# EAGLE board InkTime-SmartWatch (EAGLE 9.7.0)
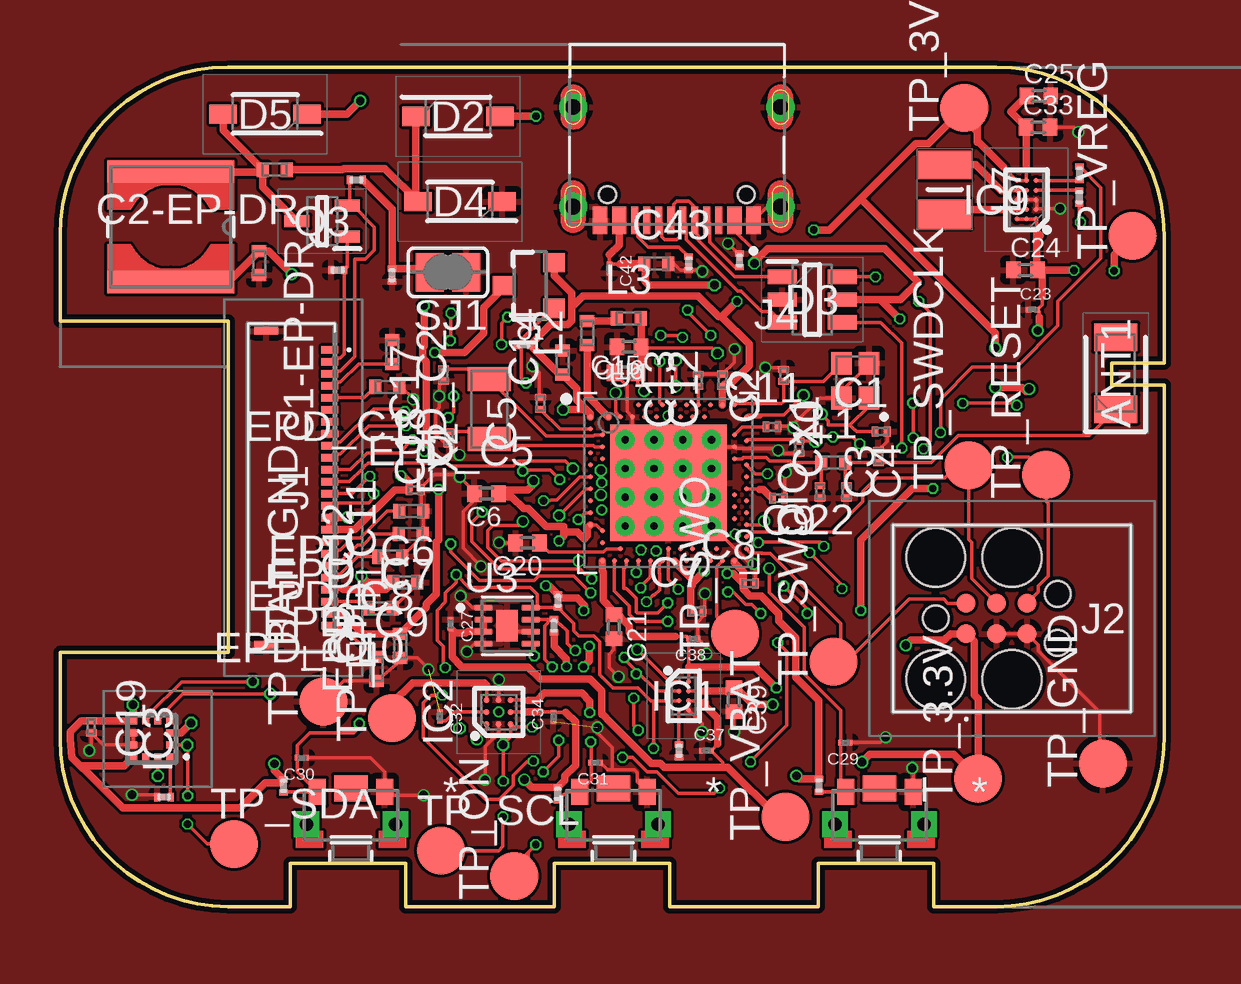
[diagram p2: board, top side]
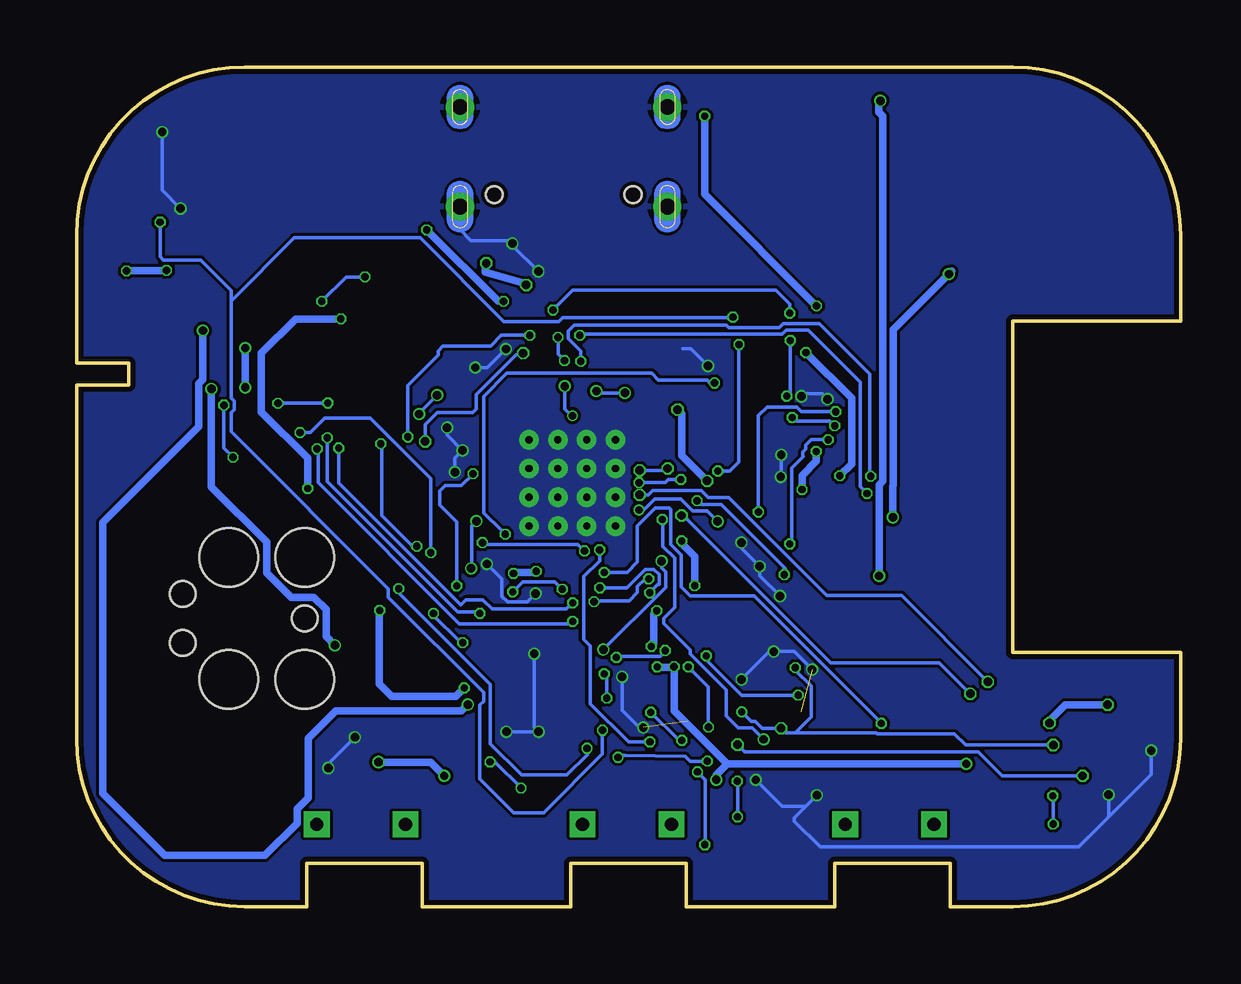
[diagram p3: board, bottom side, seen from below]

Size 46 x 35 mm. Coordinates in mm from the lower left corner, seen from the top.
Outline: 39,0 36.4,0 36.4,1.8 31.6,1.8 31.6,0 25.4,0 25.4,1.8 20.6,1.8 20.6,0 14.4,0 14.4,1.8 9.6,1.8 9.6,0 7,0 arc-90 0,7 0,10.6 7,10.6 7,24.4 0,24.4 0,28 arc-90 7,35 39,35 arc-90 46,28 46,22.66 43.83,22.66 43.83,21.75 46,21.75 46,7 arc-90 39,0
Copper layers (1*16): Top 0.035mm / dielectric 1.6mm / Bottom 0.035mm
Design rules "jlcpcb-2layers.dru": minimum track width 5mil, minimum drill 0.3mm, track to track 5mil, track to pad 5mil, pad to pad 5mil, via to via 5mil, smd to smd 5mil, copper to edge 0.2mm, drill to drill 6mil, minimum pad ring 10mil, minimum via ring 3mil, stop-mask expansion 4mil, vias tented up to drill 0mil, thermal gap 10mil

## Footprints (pad centres in the part's own frame; a part is rotated, then mirrored left to right if it is on the bottom)
2450AT18B100E_ANTC3216X140N = smd 1.15 x 1.8: 1 -1.5,0; 2 1.5,0
NORDIC_NRF_3_RESC0201_L = smd 0.28 x 0.43: 1 -0.255,0; 2 0.255,0
NORDIC_NRF_3_RESC0402_L = smd 0.5 x 0.6: 1 -0.5,0; 2 0.5,0
PERFECT_0402_0402 = smd 0.6 x 0.7: 1 -0.5,0; 2 0.5,0
GRM011R60J152KE01L_2_CAPC0201X13N = smd 0.22 x 0.23: 1 -0.185,0; 2 0.185,0
ESP32_C6_LIBRARY_5_SOD3716X135N = smd 1.15 x 0.8: 1 -1.75,0; 2 1.75,0
ESP32_C6_LIBRARY_3_SOT95P280X145-6N = smd 1.2 x 0.6: 1 -1.25,0.95; 2 -1.25,0; 3 -1.25,-0.95; 4 1.25,-0.95; 5 1.25,0; 6 1.25,0.95
BQ25180YBGR_BGA8C40P2X4_100X155X50 = smd 0.2 x 0.2: A1 -0.2,0.6; A2 0.2,0.6; B1 -0.2,0.2; B2 0.2,0.2; C1 -0.2,-0.2; C2 0.2,-0.2; D1 -0.2,-0.6; D2 0.2,-0.6
DRV2605YZFR_BGA9C50P3X3_144X144X62 = smd 0.25 x 0.25: A1 -0.5,0.5; A2 0,0.5; A3 0.5,0.5; B1 -0.5,0; B2 0,0; B3 0.5,0; C1 -0.5,-0.5; C2 0,-0.5; C3 0.5,-0.5
BMA423_BMA423 = smd 0.3 x 0.35: 1 -0.75,-0.775; 2 -0.25,-0.775; 3 0.25,-0.775; 4 0.75,-0.775; 7 0.75,0.775; 8 0.25,0.775; 9 -0.25,0.775; 10 -0.75,0.775 | smd 0.35 x 0.3: 5 0.775,-0.25; 6 0.775,0.25; 11 -0.775,0.25; 12 -0.775,-0.25
RT6160AWSC_BGA15C40P3X5_140X230X60 = smd 0.216 x 0.216: A1 -0.4,0.8; A2 0,0.8; A3 0.4,0.8; B1 -0.4,0.4; B2 0,0.4; B3 0.4,0.4; C1 -0.4,0; C2 0,0; C3 0.4,0; D1 -0.4,-0.4; D2 0,-0.4; D3 0.4,-0.4; E1 -0.4,-0.8; E2 0,-0.8; E3 0.4,-0.8
503480-2400_5034802400 = smd 0.3 x 0.7: 1 -5.75,1.525; 2 -5.25,1.525; 3 -4.75,1.525; 4 -4.25,1.525; 5 -3.75,1.525; 6 -3.25,1.525; 7 -2.75,1.525; 8 -2.25,1.525; 9 -1.75,1.525; 10 -1.25,1.525; 11 -0.75,1.525; 12 -0.25,1.525; 13 0.25,1.525; 14 0.75,1.525; 15 1.25,1.525; 16 1.75,1.525; 17 2.25,1.525; 18 2.75,1.525; 19 3.25,1.525; 20 3.75,1.525; 21 4.25,1.525; 22 4.75,1.525; 23 5.25,1.525; 24 5.75,1.525 | smd 0.3 x 1: MP1 -6.54,-1.125; MP2 6.54,-1.125
TC2030-IDC_TC2030IDC = smd 0.783 x 0.783: 1 -0.953,-0.635; 2 -0.953,0.635; 3 0.317,-0.635; 4 0.317,0.635; 5 1.588,-0.635; 6 1.588,0.635 | hole 2.451: -2.223,-2.54; -2.223,2.54; 0.952,-2.54; 0.952,2.54 | hole 1.067: -2.223,0; 2.857,-1.016; 2.857,1.016
KH-TYPE-C-16P_KINGHELM_KH-TYPE-C-16P = smd 0.6 x 1.15: A1_B12 -3.2,4.725; A4_B9 -2.4,4.725; A9_B4 2.4,4.725; A12_B1 3.2,4.725 | smd 0.3 x 1.15: A5 -1.25,4.725; A6 -0.25,4.725; A7 0.25,4.725; A8 1.25,4.725; B5 1.75,4.725; B6 0.75,4.725; B7 -0.75,4.725; B8 -1.75,4.725 | drill 0.65 pad 1.05: SH1 -4.32,0; SH2 4.32,0; SH3 -4.32,4.15; SH4 4.32,4.15 | hole 0.7: -2.89,3.65; 2.89,3.65
NORDIC_NRF_2_RESC0402_L = smd 0.5 x 0.6: 1 -0.5,0; 2 0.5,0
ESP32_C6_LIBRARY_2_IND_4828-WE-TPC_WRE = smd 0.9 x 5.3: 1 -2.286,0; 2 2.286,0
MLP2016SR47MT0S1_INDC2016X100N = smd 1.2 x 2.2: 1 -1.028,0; 2 1.028,0
ESP32_C6_LIBRARY_4_ESP32_C6_LIBRARY_4_ESP32_C6_LIBRARY_4_ESP32_C6_LIBRARY_4_ESP32_WROVER_SPARKFUN-DISCRETESEMI_SOT23-3 = smd 0.8 x 0.9: 1 -0.95,-1; 2 0.95,-1; 3 0,1.1
ESP32_C6_LIBRARY_6_SOT65P210X110-3N = smd 1.05 x 0.5: 1 -1.05,0.65; 2 -1.05,-0.65; 3 1.05,0
CPF0201D7K68C1_0201 = smd 0.35 x 0.25: 1 0,0.275; 2 0,-0.275
ESP32_C6_LIBRARY_7_JUMPER_SJ = smd 1.168 x 1.6: 1 -0.762,0; 2 0.762,0
2025-10-22_07-23-44_LIBRARY_SW_EVP-AKE31A_PAN = smd 0.711 x 1.092: 1 -1.4,-0.972; 2 1.4,-0.972 | drill 0.559 pad 0.914 square: 3 -1.848,0.381; 4 1.848,0.381 | smd 1.397 x 1.092: 5 0,-1.124
HECTOR_WATCH_1_TP20R = smd 2 x 2: TP 0,0
NORDIC_NRF_4_AQFN50P700X700X85_HS-74N = smd 4.85 x 4.85: P$74 0,0 | drill 0.3 pad 0.6: P$75 -1.8,1.8; P$76 -0.6,1.8; P$77 0.6,1.8; P$78 1.8,1.8; P$79 -1.8,0.6; P$80 -0.6,0.6; P$81 0.6,0.6; P$82 1.8,0.6; P$83 -1.8,-0.6; P$84 -0.6,-0.6; P$85 0.6,-0.6; P$86 1.8,-0.6; P$87 -1.8,-1.8; P$88 -0.6,-1.8; P$89 0.6,-1.8; P$90 1.8,-1.8 | smd 0.2 x 0.2: P$A8 -1.25,3.25; P$A10 -0.75,3.25; P$A12 -0.25,3.25; P$A14 0.25,3.25; P$A16 0.75,3.25; P$A18 1.25,3.25; P$A20 1.75,3.25; P$A22 2.25,3.25; P$A23 2.75,3.25; P$AA24 3.25,-2.25; P$AB2 -2.75,-2.5; P$AC5 -2,-2.75; P$AC9 -1,-2.75; P$AC11 -0.5,-2.75; P$AC13 0,-2.75; P$AC15 0.5,-2.75; P$AC17 1,-2.75; P$AC19 1.5,-2.75; P$AC21 2,-2.75; P$AC24 3.25,-2.75; P$AD2 -2.75,-3.25; P$AD4 -2.25,-3.25; P$AD6 -1.75,-3.25; P$AD8 -1.25,-3.25; P$AD10 -0.75,-3.25; P$AD12 -0.25,-3.25; P$AD14 0.25,-3.25; P$AD16 0.75,-3.25; P$AD18 1.25,-3.25; P$AD20 1.75,-3.25; P$AD22 2.25,-3.25; P$AD23 2.75,-3.25; P$B1 -3.25,2.75; P$B3 -2.5,2.75; P$B5 -2,2.75; P$B7 -1.5,2.75; P$B9 -1,2.75; P$B11 -0.5,2.75; P$B13 0,2.75; P$B15 0.5,2.75; P$B17 1,2.75; P$B19 1.5,2.75; P$B24 3.25,2.75; P$C1 -3.25,2.25; P$D2 -2.75,2; P$D23 2.75,2; P$E24 3.25,1.75; P$F2 -2.75,1.5; P$F23 2.75,1.5; P$G1 -3.25,1.25; P$H2 -2.75,1; P$H23 2.75,1; P$J1 -3.25,0.75; P$J24 3.25,0.75; P$K2 -2.75,0.5; P$L1 -3.25,0.25; P$L24 3.25,0.25; P$M2 -2.75,0; P$N1 -3.25,-0.25; P$N24 3.25,-0.25; P$P2 -2.75,-0.5; P$P23 2.75,-0.5; P$R1 -3.25,-0.75; P$R24 3.25,-0.75; P$T2 -2.75,-1; P$T23 2.75,-1; P$U1 -3.25,-1.25; P$U24 3.25,-1.25; P$V23 2.75,-1.5; P$W1 -3.25,-1.75; P$W24 3.25,-1.75; P$Y2 -2.75,-2; P$Y23 2.75,-2
ESP32_C6_LIBRARY_SON50P200X200X80-9N = smd 0.76 x 0.27: 1 -0.985,0.75; 2 -0.985,0.25; 3 -0.985,-0.25; 4 -0.985,-0.75; 5 0.985,-0.75; 6 0.985,-0.25; 7 0.985,0.25; 8 0.985,0.75 | smd 0.9 x 1.3: 9 0,0
NORDIC_NRF_BT-XTAL_2016_N = smd 0.95 x 0.85: 1 -0.725,-0.575; 2 0.725,-0.575; 3 0.725,0.575; 4 -0.725,0.575
NORDIC_NRF_1_XTAL_3215_N = smd 1 x 1.8: 1 -1.25,0; 2 1.25,0

## Placement (x,y rotation side)
ANT1  2450AT18B100E  [2450AT18B100E_ANTC3216X140N]  43.99,22.24 90 top
C1  12pF  [NORDIC_NRF_3_RESC0201_L]  34.22,19.8 0 top
C1-EP-DR  10uF  [NORDIC_NRF_3_RESC0402_L]  8.3,26.82 270 top
C2  12pF  [NORDIC_NRF_3_RESC0201_L]  30.15,22.15 90 top
C2-EP-DR  4.7uF/25V  [NORDIC_NRF_3_RESC0402_L]  8.95,30.71 180 top
C3  1pF  [NORDIC_NRF_3_RESC0201_L]  31.67,17.29 270 top
C4  1pF  [NORDIC_NRF_3_RESC0201_L]  32.77,17.29 270 top
C5  100nF  [NORDIC_NRF_3_RESC0201_L]  20.02,20.98 90 top
C6  4.7μF  [PERFECT_0402_0402]  17.77,17.21 180 top
C7  100nF  [NORDIC_NRF_3_RESC0201_L]  26.54,12.31 0 top
C8  100nF  [NORDIC_NRF_3_RESC0201_L]  28.72,13.47 0 top
C9  820pF  [NORDIC_NRF_3_RESC0201_L]  29.94,17.02 0 top
C10  N.C.  [NORDIC_NRF_3_RESC0201_L]  30.79,19.15 270 top
C11  100pF  [NORDIC_NRF_3_RESC0201_L]  29.67,20 0 top
C12  100nF  [NORDIC_NRF_3_RESC0201_L]  27.6,21.94 90 top
C13  N.C.  [NORDIC_NRF_3_RESC0201_L]  26.59,21.94 90 top
C14  4.7uF  [NORDIC_NRF_3_RESC0402_L]  20.94,22.68 90 top
C15  1.0uF  [PERFECT_0402_0402]  23.58,22.25 180 top
C16  47nF  [PERFECT_0402_0402]  23.71,23.33 180 top
C17  12pF  [NORDIC_NRF_3_RESC0201_L]  15.98,22.16 90 top
C18  12pF  [NORDIC_NRF_3_RESC0201_L]  16.21,19.54 90 top
C19  100nF  [NORDIC_NRF_3_RESC0201_L]  1.31,7.49 270 top
C20  4.7μF  [PERFECT_0402_0402]  19.48,15.16 180 top
C21  4.7μF  [PERFECT_0402_0402]  23.08,11.67 270 top
C22  N.C.  [NORDIC_NRF_3_RESC0201_L]  34.1,18.77 90 top
C23  0.1uF  [GRM011R60J152KE01L_2_CAPC0201X13N]  40.54,24.88 0 top
C24  10uF  [PERFECT_0402_0402]  40.22,26.54 0 top
C25  22uF  [PERFECT_0402_0402]  40.78,33.79 0 top
C27  0.1uF  [GRM011R60J152KE01L_2_CAPC0201X13N]  16.28,11.78 270 top
C29  1uF  [GRM011R60J152KE01L_2_CAPC0201X13N]  32.72,6.84 180 top
C30  1uF  [GRM011R60J152KE01L_2_CAPC0201X13N]  10.07,6.2 180 top
C31  1uF  [GRM011R60J152KE01L_2_CAPC0201X13N]  22.31,6.01 180 top
C32  1uF  [GRM011R60J152KE01L_2_CAPC0201X13N]  15.83,7.93 270 top
C33  22uF  [PERFECT_0402_0402]  40.75,32.49 0 top
C34  0.1uF  [GRM011R60J152KE01L_2_CAPC0201X13N]  20.56,7.91 90 top
C37  1uF  [GRM011R60J152KE01L_2_CAPC0201X13N]  26.94,6.5 0 top
C38  1uF  [GRM011R60J152KE01L_2_CAPC0201X13N]  26.38,11.17 180 top
C39  10uF  [PERFECT_0402_0402]  28.08,8.63 270 top
C42  0.1uF  [GRM011R60J152KE01L_2_CAPC0201X13N]  22.89,26.6 270 top
C43  4.7uF  [NORDIC_NRF_3_RESC0402_L]  24.84,26.8 0 top
D2  MBR0530  [ESP32_C6_LIBRARY_5_SOD3716X135N]  16.58,32.94 0 top
D3  USBLC6-2SC6Y  [ESP32_C6_LIBRARY_3_SOT95P280X145-6N]  31.34,25.3 0 top
D4  MBR0530  [ESP32_C6_LIBRARY_5_SOD3716X135N]  16.67,29.39 180 top
D5  MBR0530  [ESP32_C6_LIBRARY_5_SOD3716X135N]  8.54,33.04 180 top
EPD_C1  1uF/50V  [NORDIC_NRF_3_RESC0402_L]  13.63,21.66 180 top
EPD_C2  1uF/50V  [NORDIC_NRF_3_RESC0402_L]  13.84,23.12 270 top
EPD_C5  0.1uF/50V  [NORDIC_NRF_3_RESC0201_L]  14.8,17.37 0 top
EPD_C6  0.1uF/50V  [NORDIC_NRF_3_RESC0402_L]  14.64,16.48 180 top
EPD_C7  0.1uF/50V  [NORDIC_NRF_3_RESC0402_L]  14.62,15.53 180 top
EPD_C8  0.1uF/50V  [NORDIC_NRF_3_RESC0402_L]  13.76,14.59 180 top
EPD_C9  0.1uF/50V  [NORDIC_NRF_3_RESC0402_L]  14.38,13.52 180 top
EPD_C10  0.1uF/50V  [NORDIC_NRF_3_RESC0402_L]  13.36,12.43 180 top
EPD_C11  0.1uF/50V  [NORDIC_NRF_3_RESC0402_L]  14.17,10.87 90 top
EPD_C12  0.1uF/50V  [NORDIC_NRF_3_RESC0402_L]  13.19,9.9 90 top
IC1  BQ25180YBGR  [BQ25180YBGR_BGA8C40P2X4_100X155X50]  25.99,8.78 0 top
IC2  DRV2605YZFR  [DRV2605YZFR_BGA9C50P3X3_144X144X62]  18.28,8.11 90 top
IC3  BMA421  [BMA423_BMA423]  3.82,6.99 90 top
IC9  RT6160AWSC  [RT6160AWSC_BGA15C40P3X5_140X230X60]  40.27,29.46 180 top
J1  503480-2400  [503480-2400_5034802400]  9.72,17.46 270 top
J2  TC2030-IDC  [TC2030-IDC_TC2030IDC]  38.71,12.01 0 top
J4  KH-TYPE-C-16P  [KH-TYPE-C-16P_KINGHELM_KH-TYPE-C-16P]  25.7,33.33 180 top
L1  3.9nH  [NORDIC_NRF_2_RESC0402_L]  32.22,18.5 0 top
L2  10uH  [NORDIC_NRF_2_RESC0402_L]  21.96,23.91 90 top
L3  15nH  [NORDIC_NRF_2_RESC0402_L]  23.7,24.52 0 top
L5  68uH  [ESP32_C6_LIBRARY_2_IND_4828-WE-TPC_WRE]  4.62,28.33 270 top
L7  FTC252012SR47MBCA  [MLP2016SR47MT0S1_INDC2016X100N]  36.87,29.89 90 top
Q1  20V/4.2A/52mΩ/1.4W  [ESP32_C6_LIBRARY_4_ESP32_C6_LIBRARY_4_ESP32_C6_LIBRARY_4_ESP32_C6_LIBRARY_4_ESP32_WROVER_SPARKFUN-DISCRETESEMI_SOT23-3]  19.59,25.89 90 top
Q3  SI1308EDL-T1-GE3  [ESP32_C6_LIBRARY_6_SOT65P210X110-3N]  10.92,28.57 180 top
R1_EP_DR  0.47  [CPF0201D7K68C1_0201]  12.35,30.29 270 top
R1_USB  5K1  [CPF0201D7K68C1_0201]  28.31,26.94 0 top
R2  0  [CPF0201D7K68C1_0201]  42.47,30.56 0 top
R2_EP_DR  10K  [CPF0201D7K68C1_0201]  11.57,26.53 90 top
R2_USB  5K1  [CPF0201D7K68C1_0201]  26.19,26.81 0 top
R3  0  [CPF0201D7K68C1_0201]  4.33,4.57 90 top
R4  0  [CPF0201D7K68C1_0201]  42.47,29.57 180 top
R5  10k  [CPF0201D7K68C1_0201]  9.31,5.03 180 top
R7  10k  [CPF0201D7K68C1_0201]  31.62,5.05 180 top
R8  10k  [CPF0201D7K68C1_0201]  20.74,4.7 180 top
R9  10K  [CPF0201D7K68C1_0201]  25.79,6.49 180 top
R17  3K3  [CPF0201D7K68C1_0201]  20.59,11.71 180 top
R18  3K3  [CPF0201D7K68C1_0201]  20.74,12.73 0 top
R_PWR_EPD  10K  [CPF0201D7K68C1_0201]  19.31,23.41 90 top
R_TYPE_SEL  2.2  [CPF0201D7K68C1_0201]  13.84,26.32 180 top
SJ1  [ESP32_C6_LIBRARY_7_JUMPER_SJ]  16.16,26.44 180 top
SW_DN  2025-10-22_07-23-44_LIBRARY_EVP-AKE31ASW_EVP-AKE31A_PAN  [2025-10-22_07-23-44_LIBRARY_SW_EVP-AKE31A_PAN]  34.14,3.81 180 top
SW_ENT  2025-10-22_07-23-44_LIBRARY_EVP-AKE31ASW_EVP-AKE31A_PAN  [2025-10-22_07-23-44_LIBRARY_SW_EVP-AKE31A_PAN]  23.06,3.81 180 top
SW_UP  2025-10-22_07-23-44_LIBRARY_EVP-AKE31ASW_EVP-AKE31A_PAN  [2025-10-22_07-23-44_LIBRARY_SW_EVP-AKE31A_PAN]  12.12,3.81 180 top
TP_3.3V  HECTOR_WATCH_1_TPTP20R  [HECTOR_WATCH_1_TP20R]  38.25,5.33 90 top
TP_3V3  HECTOR_WATCH_1_TPTP20R  [HECTOR_WATCH_1_TP20R]  37.68,33.29 90 top
TP_BAT_GND  HECTOR_WATCH_1_TPTP20R  [HECTOR_WATCH_1_TP20R]  10.97,8.55 90 top
TP_GND  HECTOR_WATCH_1_TPTP20R  [HECTOR_WATCH_1_TP20R]  43.45,5.96 90 top
TP_ON  HECTOR_WATCH_1_TPTP20R  [HECTOR_WATCH_1_TP20R]  18.93,1.28 90 top
TP_OP  HECTOR_WATCH_1_TPTP20R  [HECTOR_WATCH_1_TP20R]  13.83,7.86 90 top
TP_RESET  HECTOR_WATCH_1_TPTP20R  [HECTOR_WATCH_1_TP20R]  41.09,18 90 top
TP_SCL  HECTOR_WATCH_1_TPTP20R  [HECTOR_WATCH_1_TP20R]  15.87,2.33 0 top
TP_SDA  HECTOR_WATCH_1_TPTP20R  [HECTOR_WATCH_1_TP20R]  7.26,2.61 0 top
TP_SWDCLK  HECTOR_WATCH_1_TPTP20R  [HECTOR_WATCH_1_TP20R]  37.86,18.39 90 top
TP_SWDIO  HECTOR_WATCH_1_TPTP20R  [HECTOR_WATCH_1_TP20R]  32.22,10.2 90 top
TP_SWO  HECTOR_WATCH_1_TPTP20R  [HECTOR_WATCH_1_TP20R]  28.12,11.38 90 top
TP_VBAT  HECTOR_WATCH_1_TPTP20R  [HECTOR_WATCH_1_TP20R]  30.22,3.74 90 top
TP_VREG  HECTOR_WATCH_1_TPTP20R  [HECTOR_WATCH_1_TP20R]  44.69,27.96 90 top
U1  NRF52840_QF  [NORDIC_NRF_4_AQFN50P700X700X85_HS-74N]  25.35,17.66 0 top
U3  MAX17048G+T10  [ESP32_C6_LIBRARY_SON50P200X200X80-9N]  18.63,11.71 0 top
X1  32MHz  [NORDIC_NRF_BT-XTAL_2016_N]  33.13,21.92 90 top
X2  32.768kHz  [NORDIC_NRF_1_XTAL_3215_N]  17.89,20.73 90 top

## Tracks (layer width: path | path; a pad name or v marks a point on that pad's centre or on a via)
3V3  (via drill 0.3, 0.35)
  Top 0.15: 40.3,30.85 40.27,30.82 IC9.E2 IC9.E3 39.32,30.81 39.32,30.82 | U1.P$W1 22.35,15.91 U1.P$Y2 | IC2.C2 19.38,8.11 | 20.03,8.11 20.55,8.11 C34.2 21.08,8.09
  Top 0.305: 40.27,30.82 40.27,32.47 C33.1 39.61,33.13 C25.1 | U1.P$AD23 28.1,14.34 28.47,13.97 C8.1 | 21.94,20.71 21.53,21.12 21.53,21.59 C14.1 20.81,22.18 R_PWR_EPD.2 20.43,24.26 21.16,24.26 21.32,24.42 21.32,24.99 | U1.P$B1 22.1,20.55 21.94,20.71 | U1.P$A22 C12.1 27.69,21.78 27.93,21.78 28.71,22.55 28.71,23.44 27.55,24.59 | 39.32,30.82 38.28,31.86 38.21,31.86 38.21,32.31 | 38.21,32.31 38.21,32.56 | IC3.10 2.68,5.87 0.86,5.87 0.96,5.76 | v33.42,6.02 33.75,6.35 37.23,6.35 TP_3.3V.TP 38.25,8.65 38.08,8.82 38.08,11.05 J2.1 37.11,11.38 36.85,11.12 35.47,11.12 v35.24,10.89 | v30.68,5.45 30.8,5.33 R7.2 31.62,8.6 30.66,9.55 30.66,11.2 29.95,11.91 29.95,12.21 29.21,12.95 28.75,12.95 28.47,13.23 C8.1 | v8.93,5.95 8.93,5.68 R5.2 9.16,5.16 8.56,5.16 7.51,4.11 2.62,4.11 0.96,5.76 | 21.94,20.71 v20.96,20.71 | Q1.2 20.59,26.29 21.32,25.56 21.32,24.99 | v3.04,8.41 IC3.7 C19.1 0.89,7.75 0.43,7.29 0.43,7 0.5,6.21 0.94,5.76 0.96,5.76 | v5.46,7.65 5.05,7.24 IC3.3 | v28.21,25.23 27.58,24.59 27.55,24.59 | 27.55,24.59 27.45,24.59 26.59,25.45 21.78,25.45 21.32,24.99 | U1.P$AD14 25.72,14.29 25.72,14.25 26.34,13.64 26.34,13.46 | 26.34,13.46 26.34,13.39 26.29,13.34 C7.1 | C8.1 28.05,13.89 v27.8,13.89 | 26.34,13.46 v26.85,13.98 | 20.99,15.62 21.55,15.62 21.84,15.33 21.97,15.46 21.97,15.78 U1.P$W1 | R17.1 20.59,10.84 21.1,10.33 v21.1,10 | 33.37,29.51 35.65,31.8 36.18,31.8 TP_3V3.TP 37.68,32.84 38.21,32.31 | 33.37,29.51 32.06,28.21 v31.41,28.21 | v19.35,5.29 19.66,4.98 R8.2 21.03,5.26 21.03,5.44 21.48,5.89 21.48,7.69 21.08,8.09 | 18.43,17.37 19.5,17.37 19.73,17.6 v19.73,17.74 | 18.43,17.37 18.39,17.37 18.68,17.08 18.83,17.08 19.32,16.59 19.51,16.59 20.26,15.84 20.99,15.84 20.99,15.62
  Top 0.305: v20.24,13.38 20.38,13.38 R18.1 20.89,12.86 21.54,12.86 21.87,12.54 21.87,12.38 v21.82,12.33 | 33.37,29.51 38.97,23.91 v38.97,23.28 | v38.97,21.64 40.1,21.64 40.27,21.47 v40.38,21.58 | 20.99,15.62 20.99,15.44 v20.79,15.24 | 18.43,17.37 C6.1 | v21.81,9.99 22.05,10.24 v22.05,10.85 | 19.38,8.11 20.03,8.11
  Bottom 0.305: v33.42,6.02 31.25,6.02 v30.68,5.45 | v8.93,5.95 18.89,5.95 | v20.96,20.71 20.79,20.54 20.79,18.81 v19.73,17.74 | v3.04,8.41 4.81,8.41 5.46,7.76 v5.46,7.65 | v27.8,13.89 27.77,13.92 26.91,13.92 v26.85,13.98 | 18.89,5.95 21.1,8.16 v21.1,10 21.15,9.96 21.78,9.96 v21.81,9.99 | v28.21,25.23 28.43,25.23 v31.41,28.21 | 18.89,5.95 19.35,5.49 v19.35,5.29 | v38.97,23.28 v38.97,21.64 | v40.38,21.58 40.38,17.5 38.08,15.2 38.08,13.92 37.06,12.9 36.12,12.9 35.6,12.38 35.6,11.25 v35.24,10.89 | v21.82,12.33 21.95,12.2 21.95,10.95 v22.05,10.85 | v20.79,15.24 20.79,15.14 20.24,14.59 v20.24,13.38
ALERT  (via drill 0.3)
  Top 0.15: v19.72,6.06 19.72,6.04 19.46,6.04 18.89,5.48 18.89,5.05 18.31,4.47 17.71,4.47 15.14,7.04 15.14,8.48 15.47,8.81 v15.93,8.81 | v27.48,4.94 27.26,4.72 25.77,4.72 24.87,5.62 24.46,5.62 23.86,6.22 v23.44,6.22 | v29.48,18.04 28.97,18.04 U1.P$J24 | v31.13,12.22 31.13,12.4 v30.16,13.37 | v28.77,6.03 30.28,7.54 30.28,10.63 v29.91,11 | U3.5 19.76,10.82 v19.76,10.45
  Bottom 0.15: 23.4,6.26 23.36,6.3 23.33,6.3 23.14,6.3 | v27.48,4.94 28.57,6.03 v28.77,6.03 | v30.16,13.37 30.16,16.03 30.86,16.73 30.86,17.33 30.64,17.55 29.97,17.55 v29.48,18.04 | v31.13,12.22 31.17,12.18 29.99,11 v29.91,11 | v19.76,10.45 19.76,10.28 18.28,8.81 v15.93,8.81 | v19.72,6.06 20.44,6.06 20.64,6.26 23.14,6.3 | 23.14,6.3 23.36,6.3 v23.44,6.22
D+  (via drill 0.3)
  Top 0.152: D3.4 34.21,24.35 35.08,23.48 v35.08,19.11 | U1.P$AD6 23.6,14.19 23.49,14.08 23.49,13.27 23.59,13.27 24.01,12.84 24.01,12.29 24.06,12.24 24.91,12.24 v25.33,12.66
  Bottom 0.152: v35.08,19.11 35.08,17.65 30,12.57 29.79,12.78 29.07,12.78 28.69,12.4 25.59,12.4 v25.33,12.66
D-  (via drill 0.3)
  Top 0.15: 23.1,13.26 23.1,13.15 23.72,12.53 23.72,12.19 24.02,11.89 v25.33,11.89
  Top 0.152: D3.6 v33.98,26.25 | v35.78,25.23 36.26,24.75 36.26,19.41 35.98,19.13 v35.98,19.08 | 23.1,13.26 U1.P$AD4
  Bottom 0.152: v33.98,26.25 34.76,26.25 v35.78,25.23 | v25.33,11.89 25.43,11.79 30.05,11.79 35.93,17.67 35.93,19.03 v35.98,19.08
DN
  Top 0.152: J4.A7 25.57,28.73 25.57,29.27 25.71,29.41 26.2,29.41 26.45,29.15 J4.B7 26.45,28.11 26.6,27.97 26.6,27.77 28.12,26.25 D3.1
DP
  Top 0.152: J4.B6 25.07,28.48 25.07,27.93 25.21,27.8 25.7,27.8 25.83,27.93 25.83,28.48 J4.A6 26.1,28.46 26.1,27.8 28.24,25.66 28.39,25.66 29.25,24.8 29.64,24.8 D3.3
EPD_3V3  (via drill 0.3, 0.35)
  Top 0.305: L5.2 7.03,26.05 C1-EP-DR.1 8.7,27.32 v9.65,26.37 | J1.15 11.31,16.28 | J1.15 J1.16 12.28,15.71 13.94,17.37 EPD_C5.1 14.54,17.71 14.29,17.96 v14.2,17.96 | J1.15 11.97,16.21 v11.99,16.23 | Q1.3 18.49,25.8 17.66,24.97 17.66,23.9 16.85,23.09 v15.61,23.09
  Bottom 0.305: v14.2,17.96 13.71,18.45 13.71,21.19 v15.61,23.09 | v11.99,16.23 11.99,17.54 11.97,17.55 11.97,24.05 v9.65,26.37 9.53,26.49
EPD_BUSY  (via drill 0.3)
  Top 0.15: J1.9 11.39,19.36 11.68,19.36 13.07,20.75 14.25,20.75 v14.37,20.63 | v17.59,16.45 17.16,16.02 17.16,15.21 18.3,14.07 21.67,14.07 21.87,13.87 21.95,13.87 v22.16,13.66 | v24.44,12.71 24.72,12.99 24.77,12.99 24.98,13.2 24.98,13.88 24.97,13.89 24.97,14.28 U1.P$AD12
  Bottom 0.15: v17.59,16.45 17.59,20.46 17.23,20.82 16,20.82 15.81,20.63 v14.37,20.63 | v24.44,12.71 24.41,12.74 22.98,12.74 22.63,13.09 22.63,13.34 22.31,13.66 v22.16,13.66
EPD_CS  (via drill 0.35)
  Top 0.15: J1.12 12.05,17.71 12.61,18.27 12.71,18.37 12.84,18.5 16.1,18.5 16.23,18.37 18.89,18.37 19.1,18.58 21.05,18.58 v21.37,18.26 | U1.P$K2 22.56,18.16 v22.54,18.18
  Bottom 0.15: v22.54,18.18 21.45,18.18 v21.37,18.26
EPD_DC  (via drill 0.3)
  Top 0.15: J1.11 12.1,18.21 12.8,18.91 14.13,18.91 v14.68,19.46 | v16.28,15.12 16.28,14.78 17.46,13.6 19.76,13.6 19.94,13.78 21.41,13.78 v22.11,13.08 | U1.P$AD10 24.6,13.75 24.2,13.35 v24.2,13.29
  Bottom 0.15: v16.28,15.12 16.2,15.2 16.2,18.29 15.72,18.77 15.74,18.79 15.74,18.95 15.61,19.08 15.61,19.23 15.38,19.46 v14.68,19.46 | v24.2,13.29 23.08,13.29 22.32,14.05 21.94,14.05 21.73,13.84 21.73,13.42 21.78,13.42 v22.11,13.08
EPD_RST  (via drill 0.3)
  Top 0.15: J1.10 11.39,18.86 11.68,18.86 12.86,20.04 v14.41,20.04 | v29.09,15.17 29.11,15.19 31.65,15.19 v31.82,15.02 | v33.32,19.29 33.03,19.58 v32.2,19.58 | v27.12,23.82 26.15,24.78 v26.15,24.87 | v16.41,21.28 16.41,20.62 v16.18,20.39 | v16.29,24.73 16.29,23.63 v16.26,23.6 | U1.P$AC11 v24.85,14.83 v24.84,14.82
  Bottom 0.15: v24.84,14.82 25.11,15.09 28.96,15.09 29.04,15.17 v29.09,15.17 | v31.82,15.02 31.99,15.02 33.28,16.31 33.28,19.12 33.32,19.16 v33.32,19.29 | v32.2,19.58 32.2,21.72 30.94,22.98 30.94,23.16 30.74,23.36 28.75,23.36 28.3,23.82 v27.12,23.82 | v26.15,24.87 25.32,25.7 16.87,25.7 16.29,25.12 v16.29,24.73 | v16.41,21.28 16.26,21.43 v16.26,23.6 | v16.18,20.39 16.03,20.24 14.61,20.24 v14.41,20.04
GDR
  Top 0.15: J1.2 11.39,22.86 11.68,22.86 11.85,23.03 R2_EP_DR.2
  Top 0.152: Q3.1 11.97,26.66 R2_EP_DR.2
GND  (via drill 0.35)  (2 unrouted)
  Top 0.15: J2.3 J2.5 40.76,10.91 40.76,10.66 43.32,8.1 43.32,6.89 | IC9.C3 IC9.C2 IC9.C1 40.71,29.42 40.71,29.1 | U1.P$74 26.55,17.66 U1.P$86 | 23.85,19.76 U1.P$75 | X1.2 33.71,22.61 32.56,21.46 X1.4 31.67,21.2 30.56,20.09 30.56,20.02 | C1.2 34.47,19.4 C22.2 | IC3.9 3.01,6.74 | 3.01,6.74 1.81,6.74 C19.2 1.31,6.59 v1.22,6.5 | 25.35,16.46 U1.P$88 | U1.P$74 U1.P$84 | U1.P$74 24.15,17.66 U1.P$79 | U1.P$74 25.35,16.46 | 25.35,16.46 U1.P$89 | U1.P$74 25.35,18.86 U1.P$77 | U1.P$74 U1.P$78 27.45,19.16 U1.P$F23 28.17,19.09 29.72,19.09 29.92,18.89 | U1.P$74 U1.P$81 U1.P$82 | J4.A1_B12 29.48,29.18 J4.SH3 | C11.2 29.96,20.04 30.54,20.04 30.56,20.02 | 30.56,20.02 v30.56,19.96 | 29.92,18.89 C10.2 | U3.6 18.88,11.46 U3.9 | U1.P$74 23.85,19.16 U1.P$B7 23.63,20.63 23.63,21.7 C15.2 | C33.2 42.23,32.49 v42.43,32.29 | v41.67,29.1 40.71,29.1 | 40.71,29.1 IC9.B1 | v30.24,18.11 30.19,18.06 C9.2 | v29.92,19.02 29.92,18.89 | IC1.D2 26.75,7.62 v26.75,7.29 | v28.09,7.29 v28.08,7.3 C39.2 | v26.76,26.48 26.71,26.54 R2_USB.2 25.84,26.54 25.57,26.8 C43.2 | R1_USB.1 28.27,27.22 v27.84,27.64 | v17.54,14.18 17.54,14.2 16.8,14.94 16.8,16.46 17.27,16.93 C6.2 17.27,17.3 v16.66,17.91 16.55,18.02 15.6,18.02 15.06,17.48 EPD_C5.2 15.06,16.57 EPD_C6.1 15.14,15.55 EPD_C7.1 15.12,15.45 EPD_C8.1 | v18.3,15.17 18.31,15.16 C20.2 | U3.4 17.28,10.96 v16.95,10.63 | v18.29,9.46 v18.28,9.45 IC2.B3 | IC3.8 3.04,6.77 3.01,6.74 | v15.15,4.64 13.66,4.64 SW_UP.1 13.52,5.62 12.94,6.2 C30.1 | U3.1 17.17,12.46 v16.69,12.94 | EPD_C9.1 14.88,13.45 EPD_C10.1 | v15.35,9.88 15.35,9.92 14.9,10.37 EPD_C11.1 14.15,10.23 EPD_C12.1 11.82,9.4 TP_BAT_GND.TP | EPD_C1.1 14.22,21.66 14.71,21.17 v14.71,21.15
  Top 0.15: C17.1 15.8,21.73 v15.8,21.27 15.8,20.8 15.66,20.66 15.66,19.7 16.08,19.29 C18.1 16.64,18.86 v16.64,18.83 | SW_ENT.1 24.05,5.19 24.05,5.58 23.94,5.69 23.01,5.69 22.82,5.69 C31.1 | R3.1 3.97,4.66 v3,4.66 | C5.2 19.96,21.3 19.96,22.27 v19.69,22.54 | C13.2 C12.2 28.09,22.69 28.09,23.22 v28.11,23.24 | v29.39,22.47 30.08,22.47 C2.2 | SW_DN.1 35.54,5.74 v35.51,5.77 | v34.4,7.06 34.18,6.84 C29.1 | v26.93,10.54 26.93,10.81 C38.1 26.57,11.88 26.8,12.11 C7.2 26.87,12.39 v26.87,13.05 | IC2.B1 18.28,7.23 17.72,6.67 17.72,5.3 v17.7,5.28 | C8.2 28.98,14.19 28.9,14.26 v28.9,14.28 28.76,14.28 25.38,17.66 U1.P$74 | U1.P$74 U1.P$90
  Top 0.152: C21.2 23.08,10.71 22.89,10.52 22.89,9.96 v23.27,9.58 | v22.39,7.46 22.39,7.26 23.01,6.64 23.01,5.69
  Bottom 0.15: v42.43,32.29 42.43,29.86 v41.67,29.1 | v30.56,19.96 30.56,19.66 v29.92,19.02 30.24,18.7 v30.24,18.11 | v28.09,7.29 v26.75,7.29 26.93,7.47 v26.93,10.54 | v26.76,26.48 27.84,27.56 | 27.84,27.56 v27.84,27.64 | v18.3,15.17 18.3,14.94 v17.54,14.18 17.54,13.79 v16.69,12.94 | v18.29,9.46 18.29,9.48 17.14,10.63 v16.95,10.63 16.1,10.63 v15.35,9.88 | v1.22,6.5 1.22,5.51 3,3.73 | 3,3.73 4.25,2.48 15.02,2.48 16.09,3.55 16.09,3.7 15.61,4.18 | 15.61,4.18 v15.15,4.64 | v14.71,21.15 14.94,21.38 15.69,21.38 v15.8,21.27 | v3,4.66 3,3.73 | v19.69,22.54 20.41,23.26 20.75,23.26 | v28.11,23.24 28.88,22.47 v29.39,22.47 | v35.51,5.77 35.51,5.95 v34.4,7.06 | 27.84,27.56 28.04,27.76 29.57,27.76 30.04,28.23 30.04,29.16 J4.SH3 | v17.7,5.28 16.6,4.18 15.61,4.18 | v28.9,14.28 28.28,13.66 28.28,12.93 28.04,12.69 27.23,12.69 v26.87,13.05 | v16.64,18.83 16.64,17.93 v16.66,17.91
  Bottom 0.152: v23.27,9.58 23.27,8.17 22.56,7.46 v22.39,7.46
  pour Top: 55.37,-4.88 55.39,-4.9 55.59,-5.09 59.29,-1.4 59.31,-1.38 59.6,-1.38 59.6,38.54 57.12,41.02 -1.01,41.02 -7.34,34.69 -7.34,-1.91 -4.37,-4.88
  pour Bottom: -6.27,34.92 -6.27,-1.92 -6.16,-1.92 -6.14,-1.94 -3.69,-4.38 54.82,-4.38 58.43,-0.77 58.32,-0.65 58.3,-0.63 58.3,38.94 56.87,40.37 -0.82,40.37
HAPTIC_EN  (via drill 0.3, 0.35)
  Top 0.15: IC2.A1 17.78,7.38 v17.37,6.97 | U1.P$U1 21.87,16.41 v21.6,16.13
  Bottom 0.15: v17.37,6.97 17.84,7.44 18.43,7.44 18.94,7.95 18.94,9.03 20.44,10.53 20.44,10.69 21.54,11.8 21.54,12.01 21.08,12.47 21.08,14.54 21.57,15.02 21.57,16.1 v21.6,16.13
IMU_INT1  (via drill 0.35)
  Top 0.15: IC3.5 4.22,7.91 4.22,7.97 5.11,8.87 v8.76,8.87 | v20.79,16.3 21.9,17.41 U1.P$N1
  Bottom 0.15: v8.76,8.87 10.05,10.16 14.57,10.16 20.72,16.3 v20.79,16.3
IMU_INT2  (via drill 0.35)
  Top 0.15: IC3.6 3.72,7.91 3.72,8.02 5.06,9.37 v8.03,9.37 | U1.P$P2 v22.54,17.16
  Bottom 0.15: v8.03,9.37 11.62,12.96 14.73,12.96 18.83,17.06 19.69,17.06 19.97,17.35 21.98,17.35 22.17,17.16 v22.54,17.16
LX1
  Top 0.15: IC9.B2 IC9.B3 39.34,29.06
  Top 0.152: L7.1 37.07,29.06 37.97,29.06
  Top 0.305: 39.34,29.06 37.97,29.06 37.55,29.06 37.54,29.07
LX2
  Top 0.15: IC9.D2 IC9.D3 39.86,29.85 39.22,29.85
  Top 0.305: L7.2 38.15,30.92 39.22,29.85
MOSI  (via drill 0.3, 0.35)
  Top 0.15: U1.P$B13 25.34,20.42 v25.34,20.46
  Top 0.152: J1.14 11.36,16.83 12.86,16.83 13.04,17.01 13.04,17.19 v13.07,17.22 | v25.67,22.76 v25.66,22.75 v25.66,21.69 | v25.03,23.81 25.86,23.81 v25.94,23.73
  Bottom 0.152: v25.94,23.73 25.94,23.03 v25.67,22.76 | v13.07,17.22 13.07,17.25 13.34,17.52 13.34,21.86 15.51,24.03 16.44,24.03 16.6,23.86 24.98,23.86 v25.03,23.81 | v25.66,21.69 25.66,20.74 25.38,20.46 v25.34,20.46
N$1
  Top 0.15: U1.P$A23 28.16,20.97 30.06,20.97 30.15,21.06 C2.1 31.8,21.89 X1.3
N$2
  Top 0.15: U1.P$H23 28.42,18.66 28.47,18.71 29.42,18.71 29.57,18.56 30.43,18.56 30.49,18.5 L1.1 31.72,17.6 C3.1
N$3  (via drill 0.35)
  Top 0.15: 29.19,20.42 29.18,20.41 U1.P$B24 28.69,20.5 30.16,20.5 v30.98,21.32 | X1.1 33.71,20.87 32.91,20.07 | 32.91,20.07 32.9,20.07 32.02,20.07 32.02,20.24 v31.73,20.53 | 32.91,20.07 33.11,19.86 33.15,19.86 33.2,19.8 C1.1
  Bottom 0.15: v30.98,21.32 31.73,20.57 v31.73,20.53
N$4
  Top 0.15: U1.P$D23 28.44,20 C11.1
N$5
  Top 0.15: J1.18 11.39,14.86 11.68,14.86 12.17,15.36 12.52,15.36 13.64,16.48 EPD_C6.2
N$6
  Top 0.152: U1.P$N24 29.13,17.41 29.15,17.39
  Top 0.305: 29.15,17.39 29.31,17.39 C9.1
N$7
  Top 0.15: C4.1 32.72,17.59 L1.2 C22.1 36.29,18.52 37.42,19.64 42.89,19.64 ANT1.1
N$8
  Top 0.15: J1.19 11.39,14.36 11.68,14.36 12.4,15.08 12.63,15.08 13.08,15.53 EPD_C7.2
N$9
  Top 0.15: U1.P$AC5 22.77,14.91 22.64,14.77 20.37,14.77 C20.1
N$10
  Top 0.15: C5.1 20.84,19.91 U1.P$C1
N$11
  Top 0.15: U1.P$D2 22.27,19.66 22.22,19.61 20.26,19.61 17.95,21.92 X2.2 17.45,22.42 C17.2
N$12
  Top 0.15: U1.P$F2 22.27,19.16 22.22,19.21 18.16,19.21 X2.1 17.58,19.8 C18.2
N$13
  Top 0.15: C13.1 U1.P$A18
N$15
  Top 0.15: IC9.E1 42.45,30.26 R2.2
N$16
  Top 0.15: IC3.1 4.59,4.59
  Top 0.152: 4.59,4.59 R3.2
N$17
  Top 0.15: IC9.D1 42.45,29.86 R4.2
N$18
  Top 0.15: J1.4 11.39,21.86 11.68,21.86 12.44,22.62 EPD_C2.2
N$19  (via drill 0.35)
  Top 0.15: v31.48,19.39 31.47,19.4 C10.1 30.73,19.47 28.66,19.47 U1.P$E24 | v27.4,23.07 27.17,23.29 24.21,23.29 | C15.1 24.08,21.79 24.34,21.53 v24.34,21.49 | v23.15,21.41 23.15,20.61 U1.P$B5
  Top 0.305: L3.2 24.21,24.51 C16.1 24.21,23.29 24.21,22.39 C15.1
  Bottom 0.15: v31.48,19.39 31.48,20.09 30.97,20.6 29.49,20.6 29.35,20.74 29.35,21.35 27.69,23.02 27.45,23.02 v27.4,23.07 | v24.34,21.49 24.26,21.41 v23.15,21.41
N$20
  Top 0.15: J1.5 12.68,21.21 EPD_C1.2
N$21
  Top 0.15: R9.2 IC1.D1
N$22
  Top 0.305: U1.P$B3 21.96,21.3 L2.1
N$23
  Top 0.305: L2.2 23.09,24.41 L3.1
N$24
  Top 0.15: J1.20 11.39,13.86 11.68,13.86 12.4,14.59 EPD_C8.2
N$25
  Top 0.305: L5.1 8.36,30.62 C2-EP-DR.2 | D5.2 6.79,32.37 C2-EP-DR.2 | C2-EP-DR.2 8.45,29.99 Q3.3
N$26
  Top 0.15: J1.22 12.58,12.71 EPD_C10.2
N$27
  Top 0.305: C2-EP-DR.1 11.76,30.71 11.82,30.77 13.54,30.77 D4.2 14.83,29.48 D2.1
N$28
  Top 0.15: J1.24 11.57,11.71 EPD_C12.2
N$32
  Top 0.305: R1_EP_DR.1 13.84,29.08 R_TYPE_SEL.2 15.25,26.59 SJ1.2
N$33
  Top 0.15: IC2.A2 16.43,8.11 16.06,7.75 C32.2
N$34
  Top 0.152: J4.B5 24.07,28.48 24.07,27.93 24.51,27.49 25.78,27.49 R2_USB.1
N$37
  Top 0.152: J4.A5 27.07,28.48 27.07,27.7 28.11,26.66 R1_USB.2
OUT+
  Top 0.15: IC2.A3 17.78,9.22
  Top 0.305: 17.78,9.22 17.67,9.33 14.69,9.33 13.83,8.47 TP_OP.TP
OUT-  (via drill 0.3)
  Top 0.15: IC2.C3 19.5,8.61 19.51,8.6 | v20.78,6.93 20.78,6.26 v20.13,5.61 | v19.82,2.58 19.51,2.27 | 19.51,2.27 19.32,2.08 | 19.51,2.27 19.51,1.86 TP_ON.TP
  Top 0.305: 19.51,8.6 19.88,8.6 20.18,8.9 21.73,8.9 22.07,8.56 v22.07,8.09
  Bottom 0.15: v22.07,8.09 20.94,6.96 20.81,6.96 v20.78,6.93 | v20.13,5.61 19.8,5.28 19.8,2.71 19.82,2.69 v19.82,2.58
P0.13  (via drill 0.3)
  Top 0.152: R5.1 9.33,4.78 SW_UP.2 9.88,5.62 C30.2 9.88,6.73 10.4,7.24 12.24,7.24 12.47,7.47 v12.47,7.63 | U1.P$AD8 24.1,14.08 24.02,14 v24.02,13.93
  Bottom 0.152: v12.47,7.63 12.47,7.66 17.76,12.95 20.43,12.95 20.8,13.32 20.8,14.65 21.25,15.09 21.25,16.55 21.3,16.61 21.88,16.61 22.63,15.86 22.63,14.36 23.06,13.93 v24.02,13.93
P0.14  (via drill 0.3)
  Top 0.15: R8.1 20.96,4.65 21,4.65 21.14,4.78 SW_ENT.2 | U1.P$AC9 24.31,14.87 v24.21,14.87
  Top 0.152: SW_ENT.2 22.12,5.25 C31.2 22.12,6.85 v22.11,6.87
  Bottom 0.152: v22.11,6.87 23,6.87 24.59,8.46 24.59,10.86 24.87,11.14 24.87,13.75 24.21,14.41 v24.21,14.87
P1.01  (via drill 0.3)
  Top 0.15: Q1.1 20.53,24.94 19.26,23.67 19.26,23.63 R_PWR_EPD.1 19.22,23.23 19.22,22.03 v19.42,21.83 | v28.14,15.52 28.1,15.56 U1.P$Y23
  Bottom 0.15: v19.42,21.83 19.61,21.83 19.73,21.95 21.76,21.95 22.04,22.23 28.07,22.23 29.03,21.27 29.03,16.41 28.29,15.67 28.06,15.67 28.06,15.54 28.08,15.52 v28.14,15.52
P1.02  (via drill 0.35)
  Top 0.15: U1.P$W24 29.18,15.91 v29.34,16.07 | C29.2 32.54,8.18 31.02,9.7 31.02,11.64 29.56,13.1 v29.56,14.1
  Top 0.152: R7.1 SW_DN.2 32.54,4.99 C29.2
  Bottom 0.15: v29.56,14.1 29.53,14.13 29.53,15.88 v29.34,16.07
PMIC_INT  (via drill 0.3, 0.35)
  Top 0.15: IC1.A1 25.38,9.38 v24.05,10.71 | v21.62,14.4 18.39,14.4 17.83,14.96 17.83,15.68 18.04,15.89 19.12,15.89 v19.29,16.06 | U1.P$T2 22.57,16.63 v22.57,16.53
  Bottom 0.15: v24.05,10.71 21.62,13.14 21.46,13.3 21.46,13.95 21.62,14.12 v21.62,14.4 | v19.29,16.06 19.72,16.49 20.33,16.49 20.83,16.99 21.91,16.99 22.37,16.53 v22.57,16.53
PREVGH  (via drill 0.35)
  Top 0.15: 11.81,13.21 J1.21
  Top 0.305: 11.81,13.21 13.57,13.21 EPD_C9.2 12.82,13.52 v12.56,13.78 | v12.51,33.59 11.96,33.04 D5.1
  Bottom 0.305: v12.51,33.59 12.57,33.53 12.57,33.12 12.4,32.95 12.4,17.73 12.56,17.58 v12.56,13.78
PREVGL  (via drill 0.3)
  Top 0.15: 11.77,12.21 J1.23
  Top 0.305: 11.77,12.21 12.61,11.37 EPD_C11.2 15.27,12.47 15.27,12.62 15.68,13.03 15.68,15.2 15.77,15.29 v15.77,17.38 | v19.83,32.95 D2.2 | v15.18,18.97 15.18,19.25 15.27,19.33 15.27,22.72 15.1,22.88 15.1,23.3 15.17,23.37 v15.17,25.04
  Bottom 0.305: v15.18,18.97 15.18,18.57 15.77,17.98 v15.77,17.38 | v15.17,25.04 19.83,29.7 v19.83,32.95
RESE
  Top 0.152: R1_EP_DR.2 12.08,29.33 Q3.2 12.21,29.22 13.1,28.33 13.1,27.36 12.72,26.98 12.29,26.98 12.29,22.93 11.69,22.33 11.36,22.33 J1.3
RESET  (via drill 0.3)
  Top 0.15: J2.6 40.76,13.11 40.76,13.36 41.17,13.77 41.17,16.81 41.09,16.89 TP_RESET.TP 40.36,18.73 v39.48,18.73 | U1.P$AC13 25.35,13.64 v25.76,13.23 | v27.83,13.12 28.05,13.12 28.58,12.59 28.83,12.59 v29.2,12.22 | v35.55,19.54 35.55,20.97 v35.53,20.99 | v37.61,20.98 39.78,20.98 v39.86,20.9
  Bottom 0.15: v25.76,13.23 26.07,13.54 27.41,13.54 v27.83,13.12 | v29.2,12.22 29.26,12.28 30.11,12.28 35.55,17.72 v35.55,19.54 | v35.53,20.99 37.59,20.99 v37.6,20.98 v37.61,20.98 | v39.48,18.73 39.86,19.11 v39.86,20.9
SCK  (via drill 0.3)
  Top 0.152: v24.99,22.73 24.99,21.02 U1.P$A12 | v12.91,17.94 12.18,17.21 J1.13
  Bottom 0.152: v24.99,22.73 24.99,23.15 25.51,23.67 25.51,23.99 25.26,24.24 18.93,24.24 18.83,24.14 16.72,24.14 16.55,24.3 15.06,24.3 12.95,22.19 12.95,17.98 v12.91,17.94
SCL  (via drill 0.3, 0.35)
  Top 0.15: 20.45,11.96 20.57,11.96 R17.2 20.81,11.76 20.85,11.76 21.13,11.48 21.13,10.96 21.42,10.67 v21.48,10.67 | 20.45,11.96 U3.7 | IC3.12 v4.08,5.45 | v19.67,7.48 18.91,7.48 IC2.C1 18.78,7.07 v18.46,6.75 v18.47,6.75 v18.47,5.23 | v42.52,28.53 42.47,28.58 R4.1 | v20.51,9.99 20.2,10.3 20.2,11.71 20.45,11.96 | v18.46,3.74 18.46,2.51 18.28,2.33 TP_SCL.TP | v23.91,8.69 23.91,7.53 v24.09,7.35 | IC1.B1 24.86,8.98 24.04,9.8 | 24.04,9.8 23.51,10.33 v23.51,10.38 | 24.04,9.8 24.02,9.78 v24.02,9.7 | v18.4,23.43 18.4,24.32 v18.65,24.57 | v19.28,18.15 19.49,18.15 19.54,18.2 20.42,18.2 v20.82,17.8 | v22.57,17.67 22.59,17.67 U1.P$M2
  Bottom 0.15: v4.08,5.45 7.43,5.45 8.43,6.45 18.16,6.45 v18.46,6.75 | v19.67,7.48 19.67,9.15 v20.51,9.99 | 39.56,25.25 39.56,25.68 40.83,26.95 42.38,26.95 42.52,27.09 v42.52,28.53 | 39.56,25.25 36.93,27.88 31.69,27.88 28.2,24.39 25.91,24.39 25.74,24.55 18.67,24.55 v18.65,24.57 | 39.56,25.25 39.56,21.21 39.43,21.08 39.43,20.72 39.56,20.59 39.56,19.8 33.01,13.25 33.01,12.89 29.04,8.93 29.04,8.55 29.2,8.4 29.2,5.33 27.78,3.91 26.54,3.91 24.09,6.36 v24.09,7.35 | v18.46,3.74 v18.46,5.22 v18.47,5.23 | v24.02,9.7 23.91,9.59 v23.91,8.69 | v18.4,23.43 18.4,18.53 18.78,18.15 v19.28,18.15 | v23.51,10.38 23.47,10.42 21.67,10.42 21.48,10.62 v21.48,10.67 | v20.82,17.8 21.34,17.8 21.47,17.67 v22.57,17.67
SDA  (via drill 0.3, 0.35)
  Top 0.15: 19.88,12.46 U3.8 | 19.88,12.46 R18.2 21.41,11.79 21.41,11.49 21.62,11.28 22.23,11.28 22.48,11.03 22.48,9.66 23.02,9.12 24.08,9.12 24.62,8.58 24.71,8.58 | 19.88,12.46 19.88,13.02 19.59,13.31 17.24,13.31 17.22,13.29 17.05,13.29 v16.51,13.84 | 5.25,6.74 v5.29,6.74 v5.3,6.73 | 5.25,6.74 IC3.2 | U1.P$L1 21.66,17.91 20.7,16.95 20.47,16.95 20.44,16.92 v20.15,16.92 | v16.05,9.96 15.97,10.04 15.97,10.84 15.71,11.1 15.71,12.34 16.06,12.69 16.06,13.07 16.51,13.52 v16.51,13.84 | 24.71,8.58 IC1.C1 | v36.69,19.76 36.69,21.16 38.02,22.49 39.86,22.49 41.58,24.21 41.58,25.25 43.37,27.03 43.37,29.98 42.51,30.84 R2.1 | v24.73,6.6 24.73,8.56 24.71,8.58 | v31.24,14.75 32.58,13.41 v32.58,13.25 | TP_SDA.TP 6.14,2.61 v5.31,3.44 | v5.32,4.62 5.32,6.67 5.25,6.74 | v16.51,13.84 16.44,13.77
  Bottom 0.15: v5.3,6.73 8.96,6.73 9.43,7.2 12.65,7.2 12.69,7.24 16.05,7.24 | v16.05,9.96 16.05,9.85 15.39,9.19 15.39,7.9 16.05,7.24 | 16.05,7.24 16.46,7.24 v16.65,7.43 17.44,7.43 17.73,7.72 17.89,7.72 IC2.B2 | v24.73,6.6 24.73,6.32 25.57,5.48 27.46,5.48 28.77,6.79 28.77,9.25 32.58,13.07 v32.58,13.25 | v36.69,19.76 36.27,19.76 35.66,20.37 33.76,20.37 31.24,17.85 v31.24,14.75 | v5.31,3.44 v5.31,4.61 v5.32,4.62 | v16.51,13.84 16.48,13.86 16.48,14.1 19.15,16.77 20,16.77 v20.15,16.92
  other vias: 18.28,8.11
SWDCLK
  Top 0.15: J2.4 37.99,13.68 37.99,15.17 37.86,15.3 TP_SWDCLK.TP 37.4,18.39 36.87,17.86 34,17.86 33.45,17.31 33.45,16.88 32.18,15.61 28.8,15.61 U1.P$AA24
SWDIO
  Top 0.15: J2.2 37,12.64 36.82,12.82 35.38,12.82 32.76,10.2 TP_SWDIO.TP
  Top 0.152: U1.P$AC24 28.77,14.74 29.25,14.74 29.23,14.72 29.6,14.72 32.53,11.79 32.53,10.51 TP_SWDIO.TP
SWO
  Top 0.15: TP_SWO.TP 27.93,11.57 27.88,11.57 27.37,12.08 27.37,14.18 U1.P$AD22
VBAT
  Top 0.15: IC1.C2 26.83,8.58 26.88,8.53 | 27.41,6.78 C37.2 27.61,6.01 27.61,5.81
  Top 0.305: 26.88,8.53 26.88,8.37 27.41,7.84 27.41,6.78 | U3.3 | U3.2 U3.3 | U3.3 17.63,11.47 16.98,11.47 16.91,11.4 16.48,11.4 C27.2 16.34,11.54 16.34,10.41 16.74,10 19.5,10 20.01,9.49 22.07,9.49 22.58,8.98 22.58,8.02 22.59,8.01 22.61,8.01 22.94,7.68 24.64,5.97 25.02,5.97 25.18,5.81 27.61,5.81 27.83,5.81 29.9,3.74 TP_VBAT.TP
VBUS  (via drill 0.3, 0.35)
  Top 0.15: IC1.A2 26.19,9.92 | 26.19,9.92 26.19,10 | J4.A4_B9 28.1,28.19 28.9,27.39 28.9,26.85 | 25.64,11.26 26.11,11.26 C38.2 26.2,9.93 26.19,9.92 | 22.89,27.17 C42.1 23.33,26.79
  Top 0.305: 34.24,25.3 35.02,25.3 35.76,26.04 34.37,27.43 29.48,27.43 28.9,26.85 v28.93,26.82 | 34.24,25.3 D3.5 | v27.27,25.91 v27.26,25.9 24.54,25.9 24.39,26.05 24.39,26.75 C43.1 23.34,26.8 23.33,26.79 | v29.85,9.11 28.96,10 26.19,10 | v33.37,12.35 33.37,15.29 35.51,17.43 v36.37,17.43 | v34.99,24.5 34.24,25.25 34.24,25.3 | 23.08,12.3 22.63,12.76 22.63,13.95 22.6,13.98 U1.P$AD2 | 23.51,11.9 23.71,11.7 23.71,11.43 23.89,11.25 25.63,11.25 25.64,11.26 | 23.51,11.9 23.37,12.04 23.37,12.07 | 23.08,12.3 C21.1 | 23.51,11.9 23.49,11.9 23.08,12.3 | J4.A9_B4 23.3,27.58 22.89,27.17
  Bottom 0.305: v27.27,25.91 27.36,26 28.97,26.45 28.97,26.79 v28.93,26.82 | v29.85,9.11 30.2,8.76 32.87,8.76 33.39,9.28 33.39,12.33 v33.37,12.35 | v36.37,17.43 36.37,18.7 38.29,20.62 38.29,23.07 36.86,24.5 v34.99,24.5
VREG  (via drill 0.3, 0.35)
  Top 0.15: 40.69,28.12 40.69,28.64 IC9.A1 IC9.A2 IC9.A3 | IC1.B2 26.78,8.98 | 40.93,25.4 40.93,25.09 C23.2 40.81,24.79 40.81,24.57
  Top 0.305: C24.2 40.69,26.57 40.69,28.12 40.85,27.96 | 26.78,8.98 27.93,8.98 C39.1 28.15,9.13 28.86,8.42 v29.7,8.42 | 40.81,24.57 40.81,24.08 v40.74,24.01 | C24.2 42.23,26.54 v42.25,26.52 | v43.92,26.5 43.92,27.19 TP_VREG.TP | 40.93,25.4 40.93,26.33 C24.2
  Bottom 0.305: v42.25,26.52 43.9,26.52 v43.92,26.5 | v29.7,8.42 29.97,8.15 35.21,8.15 36.35,7.01 36.35,4.53 36.8,4.08 36.8,3.48 38.15,2.13 42.32,2.13 44.91,4.72 44.91,16.02 40.91,20.02 40.91,21.8 40.74,21.97 v40.74,24.01